# EAGLE design LED_Dimmer2 (EAGLE 9.4.2)
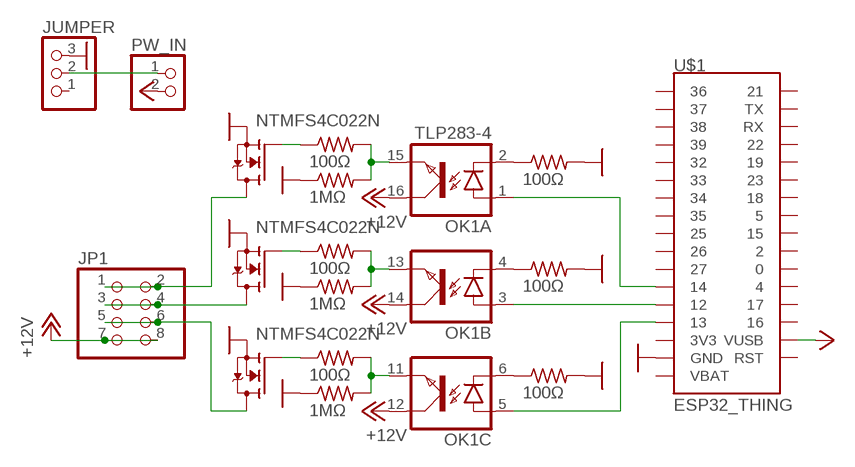
[diagram p0: schematic, sheet 1]

## Parts
JP1  PINHD-2X4  [2X04]
JUMPER  PINHD-1X3  [1X03]
OK1  TLP283-4  [MINI-FLAT-16]
PW_IN  PINHD-1X2  [1X02]
Q1  NTMFS4C022N  [SO-8FL]
Q2  NTMFS4C022N  [SO-8FL]
Q3  NTMFS4C022N  [SO-8FL]
R1  100Ω  R-US_R0805  [R0805]
R2  1MΩ  R-US_R0805  [R0805]
R3  100Ω  R-US_R0805  [R0805]
R4  1MΩ  R-US_R0805  [R0805]
R5  100Ω  R-US_R0805  [R0805]
R6  1MΩ  R-US_R0805  [R0805]
R7  100Ω  R-US_R0805  [R0805]
R8  100Ω  R-US_R0805  [R0805]
R9  100Ω  R-US_R0805  [R0805]
U$1  ESP32_THING  [ESP32_THING]

## Nets
+5V: PW_IN.2 U$1.P19(VUSB) U$1.P22(VUSB)
+12V: JP1.7 JP1.8 OK1.12(C:COL) OK1.14(B:COL) OK1.16(A:COL)
GND: JUMPER.3 Q1.P$1(S) Q1.P$2(S) Q1.P$3(S) Q2.P$1(S) Q2.P$2(S) Q2.P$3(S) Q3.P$1(S) Q3.P$2(S) Q3.P$3(S) R2.1 R4.1 R6.1 R7.2 R8.2 R9.2 U$1.P17(GND) U$1.P20(GND) U$1.P21(GND) U$1.P24(GND) U$1.P40(GND)
N$1: JP1.1 JP1.2 Q1.P$5(D)
N$2: Q1.P$4(G) R1.1
N$3: OK1.15(A:EMIT) R1.2 R2.2
N$4: JP1.3 JP1.4 Q2.P$5(D)
N$5: Q2.P$4(G) R3.1
N$6: OK1.13(B:EMIT) R3.2 R4.2
N$7: JP1.5 JP1.6 Q3.P$5(D)
N$8: Q3.P$4(G) R5.1
N$9: OK1.11(C:EMIT) R5.2 R6.2
N$10: OK1.4(B:C) R7.1
N$11: OK1.6(C:C) R8.1
N$12: OK1.2(A:C) R9.1
N$13: OK1.3(B:A) U$1.P13
N$14: OK1.1(A:A) U$1.P12
N$15: OK1.5(C:A) U$1.P14
N$16: JUMPER.2 PW_IN.1
Unconnected: JUMPER.1 OK1.7(D:A) OK1.8(D:C) OK1.9(D:EMIT) OK1.10(D:COL) U$1.P1 U$1.P2 U$1.P3 U$1.P4 U$1.P5 U$1.P6 U$1.P7 U$1.P8 U$1.P9 U$1.P10 U$1.P11 U$1.P15(RST) U$1.P16(3V3) U$1.P18(VBAT) U$1.P23(VBAT) U$1.P25(3V3) U$1.P26 U$1.P27 U$1.P28 U$1.P29 U$1.P30 U$1.P31 U$1.P32 U$1.P33 U$1.P34 U$1.P35 U$1.P36 U$1.P37(RX) U$1.P38(TX) U$1.P39

## Library data of the parts
JP1 = pinhead:PINHD-2X4: PIN HEADER
JUMPER = pinhead:PINHD-1X3: PIN HEADER
OK1 = optocoupler:TLP283-4: TOSHIBA PHOTOCOUPLER GaAs IRED & PHOTO-TRANSISTOR Source: http://www.semicon.toshiba.co.jp/td/en/Opto/Photocoupler/en_20050928_TLP283_datasheet.pdf; OC_FARNELL: unknown; OC_NEWARK: unknown
PW_IN = pinhead:PINHD-1X2: PIN HEADER
Q1-Q3 = Personal:NTMFS4C022N: OnSemiconductor NVMFS4C03N (http://www.onsemi.com/pub/Collateral/NVMFS4C03N-D.PDF)
R1-R9 = rcl:R-US_: RESISTOR, American symbol; SPICEPREFIX: R
U$1 = Personal:ESP32_THING

## Board
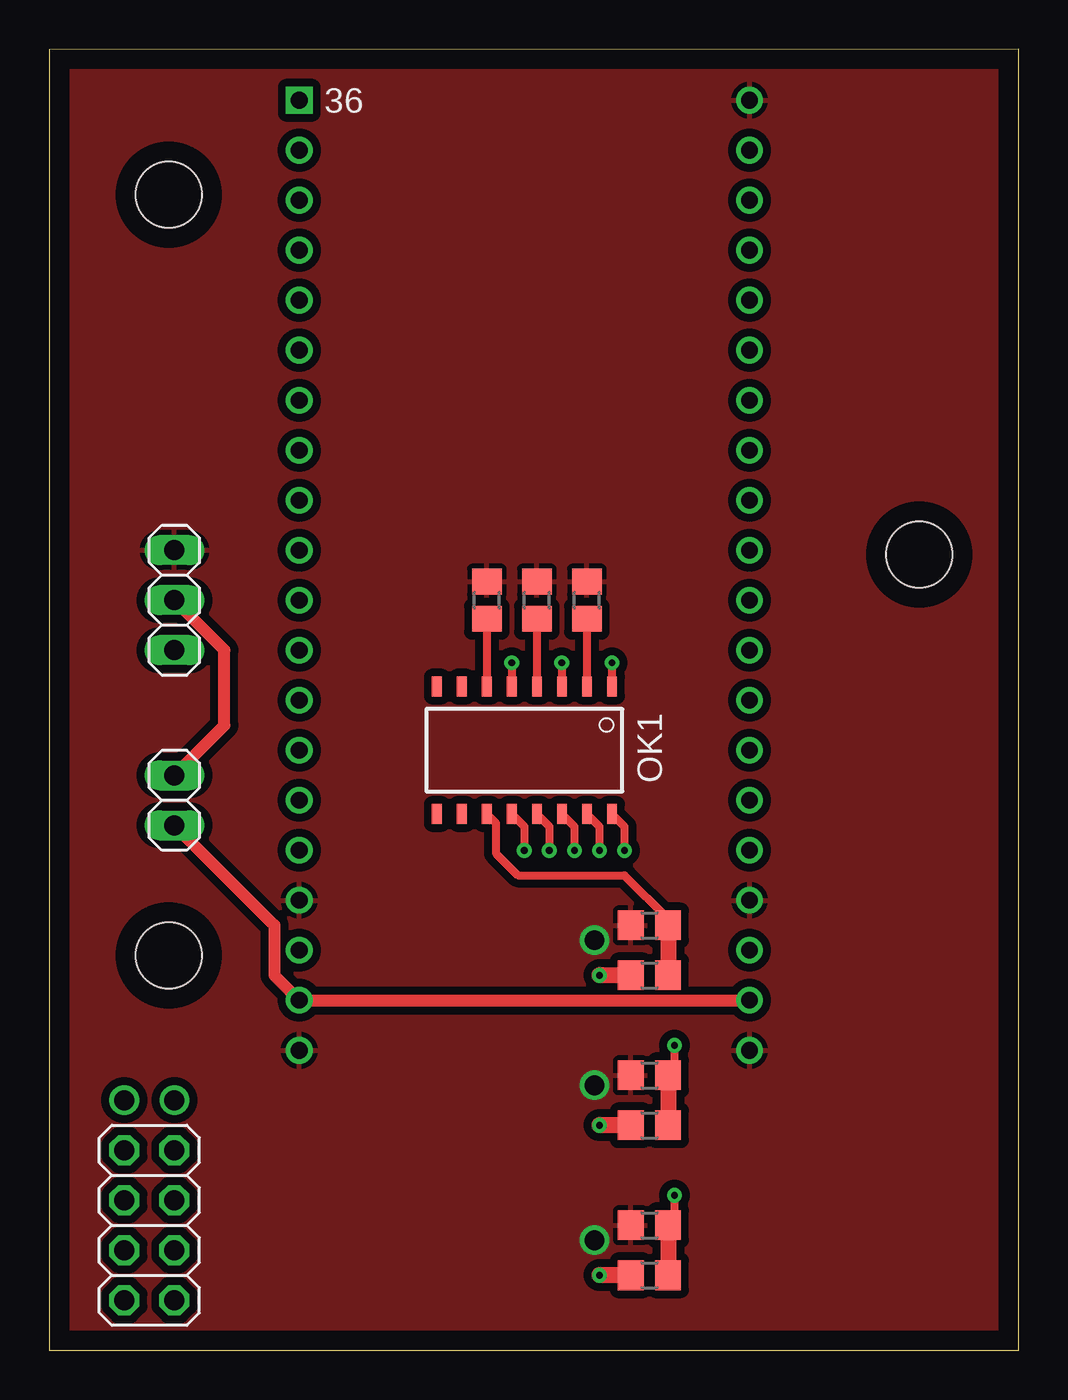
[diagram p1: board, top side]
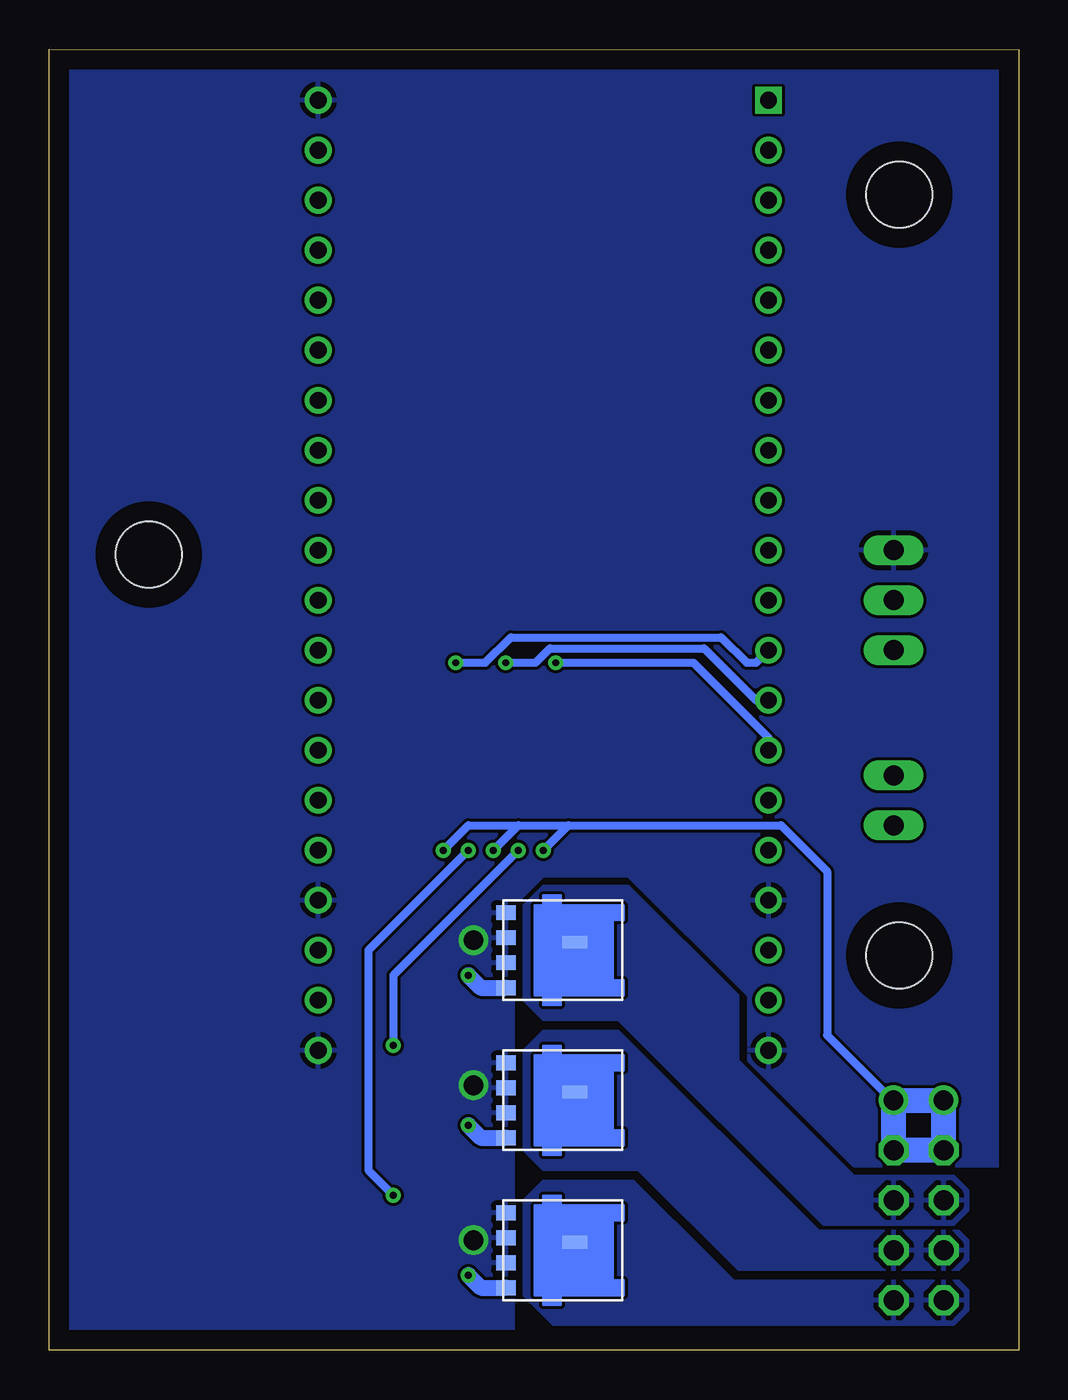
[diagram p2: board, bottom side, seen from below]

Size 49.23 x 66.09 mm. Coordinates in mm from the lower left corner, seen from the top.
Outline: 0,0 49.23,0 49.23,66.09 0,66.06 0,0
Copper layers (1*16): Top 0.035mm / dielectric 1.5mm / Bottom 0.035mm
Design rules "default": minimum track width 6mil, minimum drill 0.35mm, track to track 6mil, track to pad 6mil, pad to pad 6mil, via to via 6mil, smd to smd 6mil, copper to edge 40mil, drill to drill 6mil, minimum pad ring 10mil, minimum via ring 8mil, stop-mask expansion 4mil, vias tented up to drill 0mil, thermal gap 10mil
Holes 3.35 mm at 6.07,20.07 6.07,58.7 44.17,40.41

### Footprints (pad centres in the part's own frame; a part is rotated, then mirrored left to right if it is on the bottom)
2X04 = drill 1.016 octagon: 1 -3.81,-1.27; 2 -3.81,1.27; 3 -1.27,-1.27; 4 -1.27,1.27; 5 1.27,-1.27; 6 1.27,1.27; 7 3.81,-1.27; 8 3.81,1.27
1X03 = drill 1.016 long: 1 -2.54,0; 2 0,0; 3 2.54,0
MINI-FLAT-16 = smd 1 x 0.5: 1 -3.24,4.445; 2 -3.24,3.175; 3 -3.24,1.905; 4 -3.24,0.635; 5 -3.24,-0.635; 6 -3.24,-1.905; 7 -3.24,-3.175; 8 -3.24,-4.445; 9 3.24,-4.445; 10 3.24,-3.175; 11 3.24,-1.905; 12 3.24,-0.635; 13 3.24,0.635; 14 3.24,1.905; 15 3.24,3.175; 16 3.24,4.445
1X02 = drill 1.016 long: 1 -1.27,0; 2 1.27,0
SO-8FL = smd 0.75 x 1: P$1 -1.905,-3.175; P$2 -0.635,-3.175; P$3 0.635,-3.175; P$4 1.905,-3.175 | smd 0.635 x 1.27: P$5 -0.405,0.325
R0805 = smd 1.3 x 1.5: 1 -0.95,0; 2 0.95,0
ESP32_THING = drill 0.85 square: P1 0,48.26 | drill 0.85: P2 0,45.72; P3 0,43.18; P4 0,40.64; P5 0,38.1; P6 0,35.56; P7 0,33.02; P8 0,30.48; P9 0,27.94; P10 0,25.4; P11 0,22.86; P12 0,20.32; P13 0,17.78; P14 0,15.24; P15 0,12.7; P16 0,10.16; P17 0,7.62; P18 0,5.08; P19 0,2.54; P20 0,0; P21 22.86,0; P22 22.86,2.54; P23 22.86,5.08; P24 22.86,7.62; P25 22.86,10.16; P26 22.86,12.7; P27 22.86,15.24; P28 22.86,17.78; P29 22.86,20.32; P30 22.86,22.86; P31 22.86,25.4; P32 22.86,27.94; P33 22.86,30.48; P34 22.86,33.02; P35 22.86,35.56; P36 22.86,38.1; P37 22.86,40.64; P38 22.86,43.18; P39 22.86,45.72; P40 22.86,48.26

### Placement (x,y rotation side)
JP1  5.08,6.35 90 top
JUMPER  6.35,38.1 90 top
OK1  24.13,30.48 270 top
PW_IN  6.35,27.94 270 top
Q1  22.86,5.08 270 bottom
Q2  22.86,12.7 270 bottom
Q3  22.86,20.32 270 bottom
R1  30.48,3.81 0 top
R2  30.48,6.35 0 top
R3  30.48,11.43 0 top
R4  30.48,13.97 0 top
R5  30.48,19.05 0 top
R6  30.48,21.59 0 top
R7  24.77,38.1 90 top
R8  22.23,38.1 90 top
R9  27.3,38.1 90 top
U$1  12.7,15.24 0 top

### Tracks (layer width: path | path; a pad name or v marks a point on that pad's centre or on a via)
+5V
  Top 0.61: U$1.P22 U$1.P19 11.43,19.05 11.43,21.59 PW_IN.2
+12V  (via drill 0.35, 1)
  Top 0.406: OK1.12 24.13,26.6 v24.13,25.4 | OK1.14 26.67,26.6 v26.67,25.4 | OK1.16 29.21,26.6 v29.21,25.4
  Bottom 0.406: v29.21,25.4 27.94,26.67 25.4,26.67 | 25.4,26.67 22.86,26.67 | 22.86,26.67 12.06,26.67 9.73,24.33 9.73,16 6.43,12.7 v6.35,12.7 | v26.67,25.4 25.4,26.67 | v24.13,25.4 22.86,26.67
  Bottom 1.27: JP1.8 v3.81,12.7 v6.35,12.7 JP1.7 JP1.8
GND  (via drill 1)
  other vias: 27.69,13.46 27.69,20.83 27.69,5.59
  pour Top (isolate 0.406): 0,0 0,66.04 49.28,66.04 49.28,0
  pour Bottom: -0.25,66.04 49.28,66.04 49.28,0 25.65,0 25.65,22.61 24.13,24.13 19.81,24.13 13.72,18.03 13.72,14.73 8.38,9.4 -0.25,9.4
N$1
  pour Bottom: 3.05,3.56 2.54,3.05 2.54,2.03 3.3,1.27 13.21,1.27 23.62,1.27 25.15,2.79 25.15,7.62 24.13,8.64 19.56,8.64 15.49,4.57 14.48,3.56
N$2  (via drill 0.35)
  Top 0.813: R1.1 v27.94,3.81
  Bottom 0.813: v27.94,3.81 27.3,3.17 Q1.P$4
N$3  (via drill 0.35)
  Top 0.406: OK1.15 27.94,26.6 v27.94,25.4 | v31.75,7.87 31.75,6.67 R2.2
  Top 0.813: R2.2 R1.2
  Bottom 0.406: v27.94,25.4 33.02,20.32 33.02,9.14 v31.75,7.87
N$4
  pour Bottom: 3.3,6.1 3.05,6.1 2.54,5.59 2.54,4.57 3.05,4.06 14.22,4.06 19.3,9.14 24.13,9.14 25.15,10.16 25.15,15.24 24.13,16.26 20.32,16.26 10.16,6.1
N$5  (via drill 0.35)
  Top 0.813: R3.1 v27.94,11.43
  Bottom 0.813: v27.94,11.43 27.3,10.79 Q2.P$4
N$6  (via drill 0.35)
  Top 0.406: OK1.13 25.4,26.6 v25.4,25.4 | v31.75,15.49 31.75,14.29 R4.2
  Top 0.813: R4.2 R3.2
  Bottom 0.406: v25.4,25.4 31.75,19.05 v31.75,15.49
N$7
  pour Bottom: 3.3,8.89 2.54,8.13 2.54,7.11 3.3,6.35 9.91,6.35 20.32,16.76 24.13,16.76 25.15,17.78 25.15,22.61 24.13,23.62 19.81,23.62 14.22,18.03 14.22,14.73 8.38,8.89
N$8  (via drill 0.35)
  Top 0.813: R5.1 v27.94,19.05
  Bottom 0.813: v27.94,19.05 27.3,18.41 Q3.P$4
N$9
  Top 0.406: OK1.11 22.69,26.78 22.69,25.24 23.8,24.13 29.21,24.13 31.43,21.91 R6.2
  Top 0.813: R6.2 R5.2
N$10
  Top 0.406: R7.1 OK1.4
N$11
  Top 0.406: R8.1 OK1.6
N$12
  Top 0.406: R9.1 OK1.2
N$13  (via drill 0.35)
  Top 0.406: v26.04,34.92 OK1.3
  Bottom 0.406: v26.04,34.92 24.53,34.92 23.8,35.66 15.97,35.66 13.34,33.02 U$1.P13
N$14  (via drill 0.35)
  Top 0.406: v28.57,34.92 OK1.1
  Bottom 0.406: U$1.P12 13.34,34.92 13.81,34.92 15.11,36.22 25.78,36.22 27.07,34.92 v28.57,34.92
N$15  (via drill 0.35)
  Top 0.406: v23.5,34.92 OK1.5
  Bottom 0.406: U$1.P14 12.7,31.11 16.51,34.92 v23.5,34.92
N$16
  Top 0.61: PW_IN.1 8.89,31.75 8.89,35.56 JUMPER.2

### Text on the board
tCream: OFF ON | 5V EN